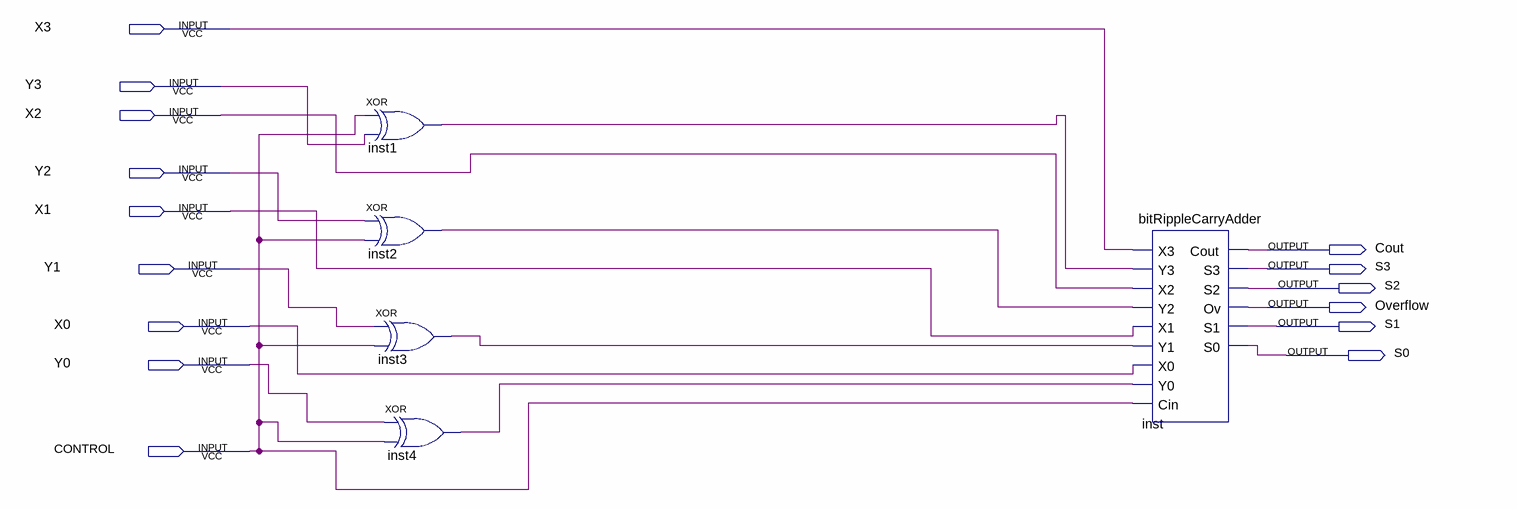
[diagram p0: schematic sheet]
// Quartus schematic finalStep.bdf as structural Verilog: 5 symbols, 15 pins
module finalStep (
  input  X3,
  input  Y3,
  input  X2,
  input  Y2,
  input  X1,
  input  Y1,
  input  X0,
  input  Y0,
  input  CONTROL,
  output Cout,
  output S3,
  output S2,
  output Overflow,
  output S1,
  output S0
);

  wire inst1_out, inst2_out, inst3_out, inst4_out;

  xor inst1 (inst1_out, CONTROL, Y3);
  xor inst2 (inst2_out, Y2, CONTROL);
  xor inst3 (inst3_out, Y1, CONTROL);
  xor inst4 (inst4_out, Y0, CONTROL);
  bitRippleCarryAdder inst (
    .X3(X3), .Y3(inst1_out), .X2(X2), .Y2(inst2_out), .X1(X1), .Y1(inst3_out), .X0(X0), .Y0(inst4_out),
    .Cin(CONTROL), .Cout(Cout), .S3(S3), .S2(S2), .Ov(Overflow), .S1(S1), .S0(S0));
endmodule
